# Altium schematic sheet 28_PP0_SGMII, LED, TWSI.SchDoc
size 419 x 296 mm; Author: Serbinov O.A.; CompanyName: ELSICOM; DrawnBy: Serbinov O.A.; Engineer: Serbinov O.A.; Organization: Elsicom; Address1: Kirova avenue, 58; Address2: Tomsk; Address3: Russia 634012; DocumentNumber: 29; SheetNumber: 29; SheetTotal: 44; ProjectName: 48_PORTS
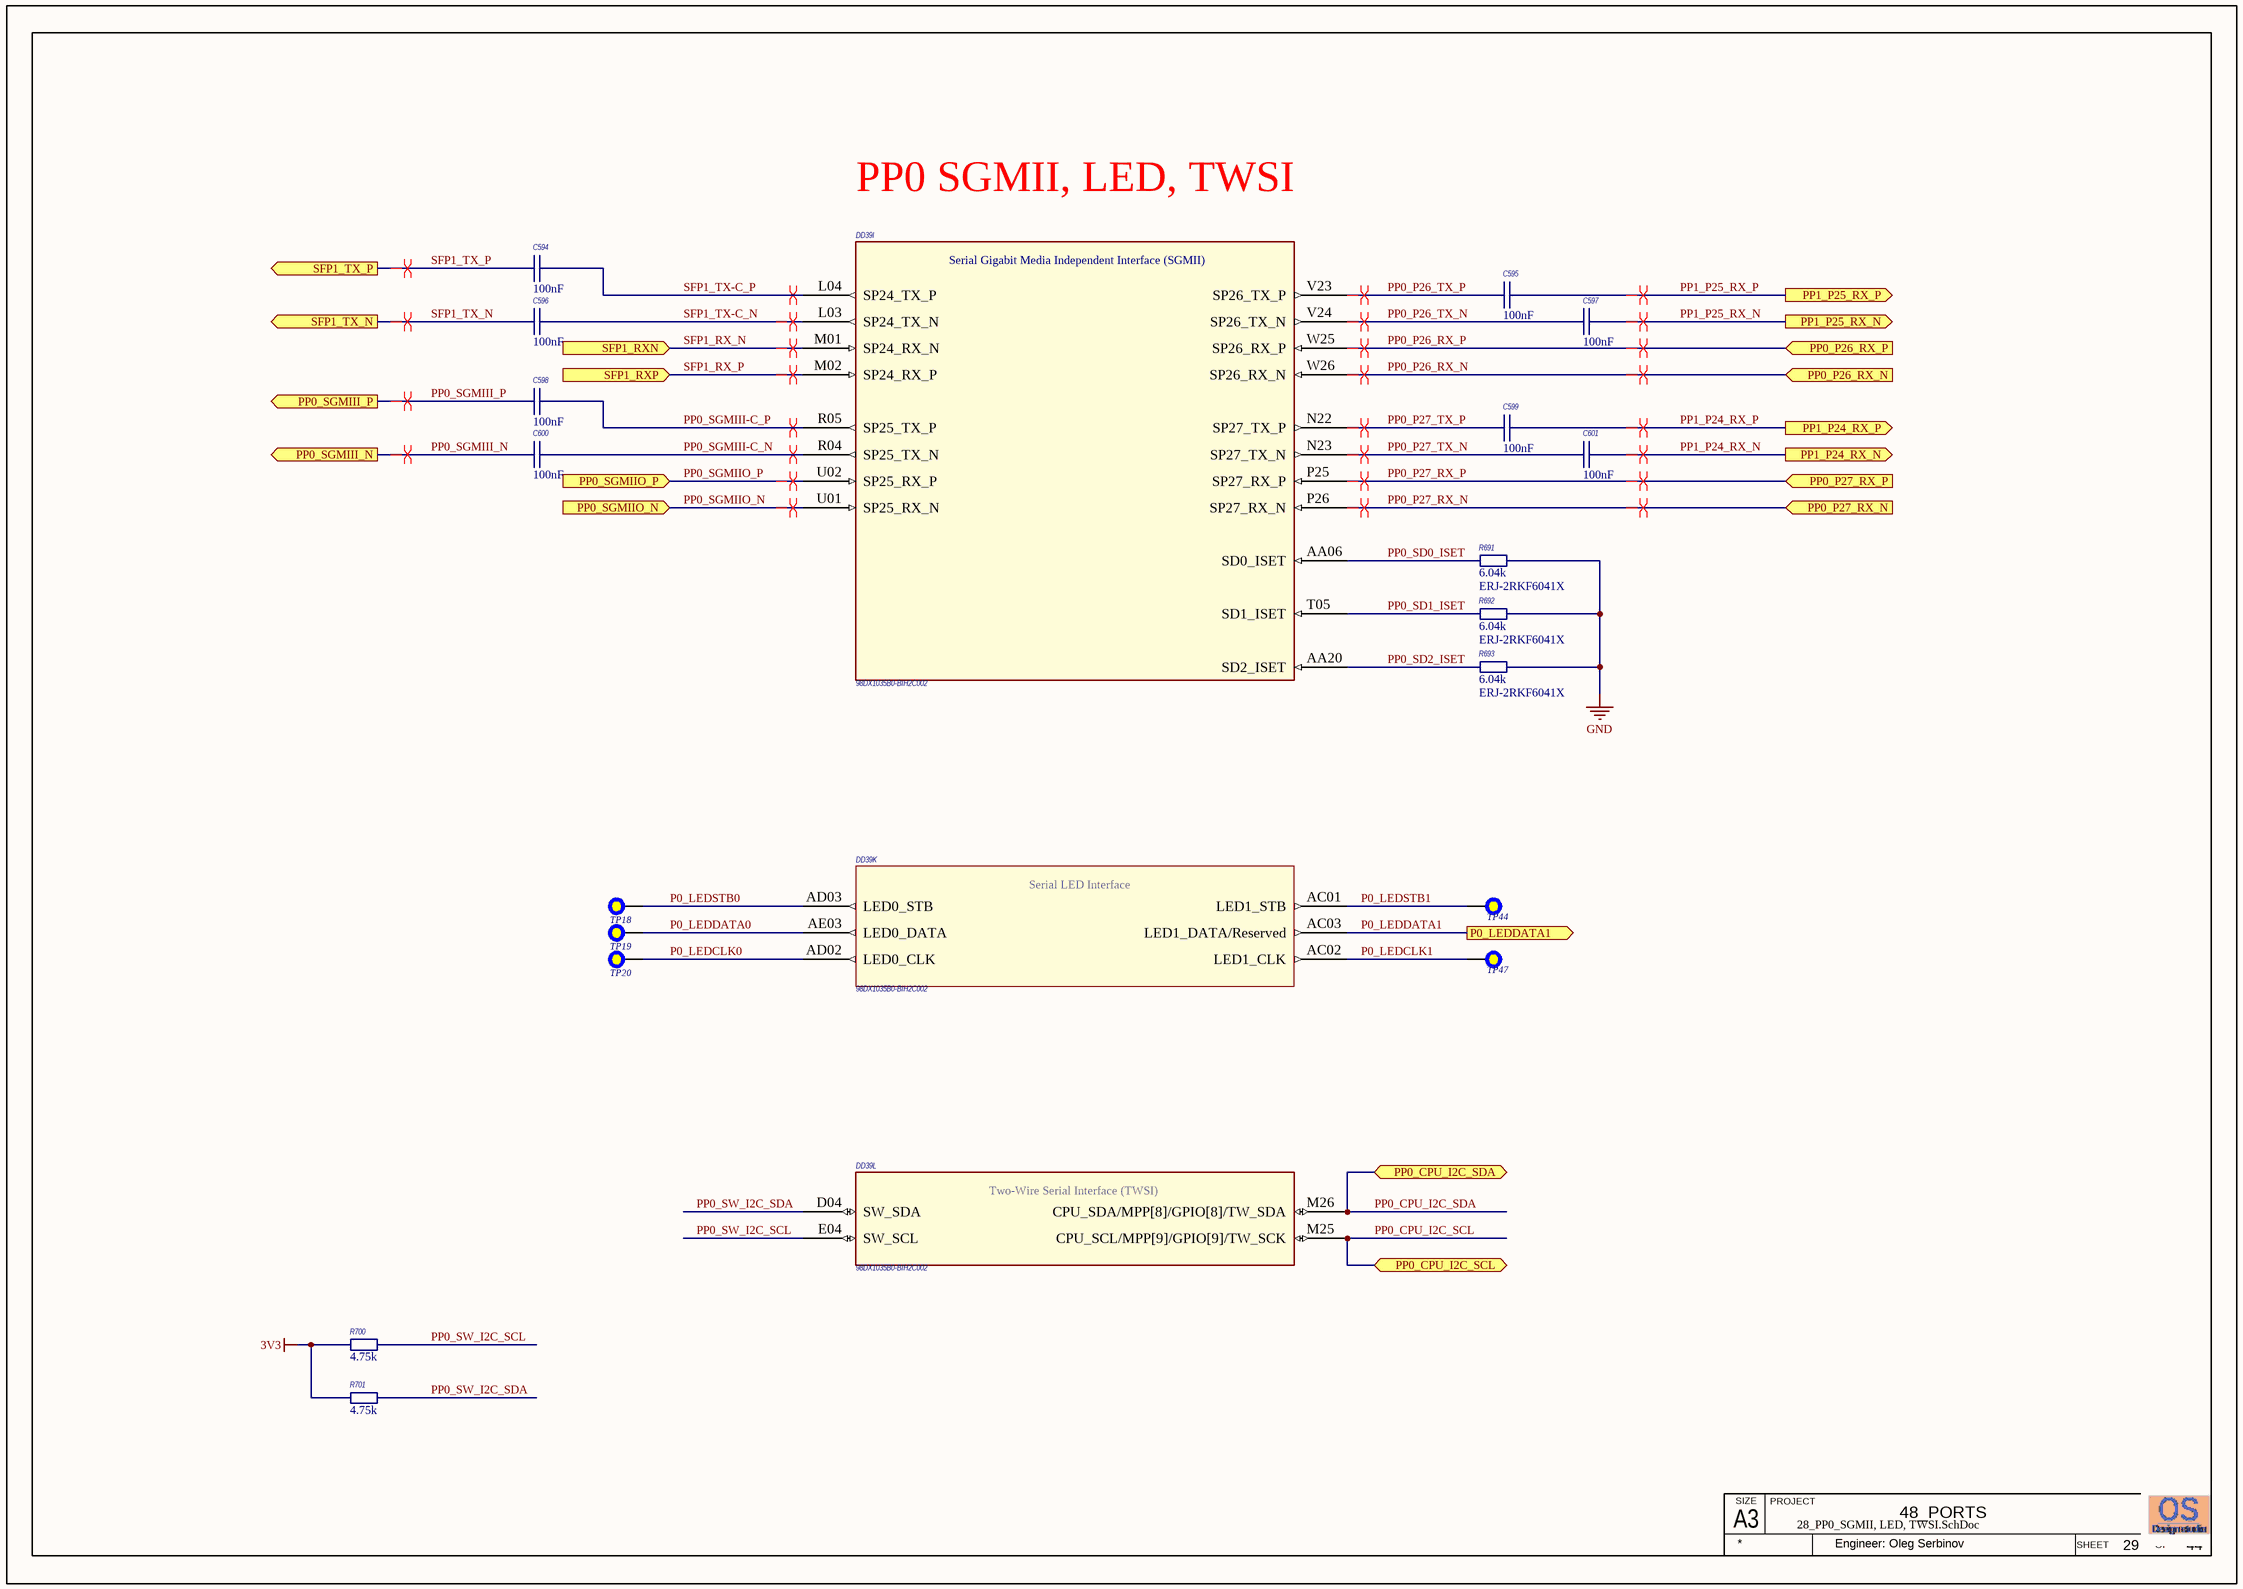
[diagram p0: 28_PP0_SGMII, LED, TWSI.SchDoc]

## Parts
C594  Capacitance: 100nF  [C0402_IPC High Density]  (hidden comment: GRM155R71E104KE14D)
C595  Capacitance: 100nF  [C0402_IPC High Density]  (hidden comment: GRM155R71E104KE14D)
C596  Capacitance: 100nF  [C0402_IPC High Density]  (hidden comment: GRM155R71E104KE14D)
C597  Capacitance: 100nF  [C0402_IPC High Density]  (hidden comment: GRM155R71E104KE14D)
C598  Capacitance: 100nF  [C0402_IPC High Density]  (hidden comment: GRM155R71E104KE14D)
C599  Capacitance: 100nF  [C0402_IPC High Density]  (hidden comment: GRM155R71E104KE14D)
C600  Capacitance: 100nF  [C0402_IPC High Density]  (hidden comment: GRM155R71E104KE14D)
C601  Capacitance: 100nF  [C0402_IPC High Density]  (hidden comment: GRM155R71E104KE14D)
DD39  98DX1035B0-BIH2C002  [HSBGA617_27X27_1MM]  (parts I,K,L of 16)
R691  Resistance (Ohms): 6.04k  [R0402_IPC High Density]  (hidden comment: ERJ-2RKF6041X)
R692  Resistance (Ohms): 6.04k  [R0402_IPC High Density]  (hidden comment: ERJ-2RKF6041X)
R693  Resistance (Ohms): 6.04k  [R0402_IPC High Density]  (hidden comment: ERJ-2RKF6041X)
R700  Resistance (Ohms): 4.75k  [R0402_IPC High Density]  (hidden comment: ERJ-2RKF4751X)
R701  Resistance (Ohms): 4.75k  [R0402_IPC High Density]  (hidden comment: ERJ-2RKF4751X)
TP18  Test Point 0.5mm pad  [Test Point 0.5mm]  (value not drawn)  (no BOM)
TP19  Test Point 0.5mm pad  [Test Point 0.5mm]  (value not drawn)  (no BOM)
TP20  Test Point 0.5mm pad  [Test Point 0.5mm]  (value not drawn)  (no BOM)
TP44  Test Point 0.5mm pad  [Test Point 0.5mm]  (value not drawn)  (no BOM)
TP47  Test Point 0.5mm pad  [Test Point 0.5mm]  (value not drawn)  (no BOM)

## Ports
P0_LEDDATA1 (out), PP0_CPU_I2C_SCL (bidir), PP0_CPU_I2C_SDA (bidir), PP0_P26_RX_N (in), PP0_P26_RX_P (in), PP0_P27_RX_N (in), PP0_P27_RX_P (in), PP0_SGMIII_N (out), PP0_SGMIII_P (out), PP0_SGMIIO_N (in), PP0_SGMIIO_P (in), PP1_P24_RX_N (out), PP1_P24_RX_P (out), PP1_P25_RX_N (out), PP1_P25_RX_P (out), SFP1_RXN (in), SFP1_RXP (in), SFP1_TX_N (out), SFP1_TX_P (out)

## Nets
3V3: R700.1 R701.1
GND: R691.2 R692.2 R693.2
P0_LEDCLK0: DD39.AD02(LED0_CLK) TP20.1
P0_LEDCLK1: DD39.AC02(LED1_CLK) TP47.1
P0_LEDDATA0: DD39.AE03(LED0_DATA) TP19.1
P0_LEDDATA1: DD39.AC03(LED1_DATA/Reserved) ; port P0_LEDDATA1
P0_LEDSTB0: DD39.AD03(LED0_STB) TP18.1
P0_LEDSTB1: DD39.AC01(LED1_STB) TP44.1
PP0_CPU_I2C_SCL: DD39.M25(CPU_SCL/MPP[9]/GPIO[9]/TW_SCK) ; port PP0_CPU_I2C_SCL
PP0_CPU_I2C_SDA: DD39.M26(CPU_SDA/MPP[8]/GPIO[8]/TW_SDA) ; port PP0_CPU_I2C_SDA
PP0_P26_RX_N: DD39.W26(SP26_RX_N) ; port PP0_P26_RX_N
PP0_P26_RX_P: DD39.W25(SP26_RX_P) ; port PP0_P26_RX_P
PP0_P26_TX_N: C597.2 DD39.V24(SP26_TX_N)
PP0_P26_TX_P: C595.2 DD39.V23(SP26_TX_P)
PP0_P27_RX_N: DD39.P26(SP27_RX_N) ; port PP0_P27_RX_N
PP0_P27_RX_P: DD39.P25(SP27_RX_P) ; port PP0_P27_RX_P
PP0_P27_TX_N: C601.2 DD39.N23(SP27_TX_N)
PP0_P27_TX_P: C599.2 DD39.N22(SP27_TX_P)
PP0_SD0_ISET: DD39.AA06(SD0_ISET) R691.1
PP0_SD1_ISET: DD39.T05(SD1_ISET) R692.1
PP0_SD2_ISET: DD39.AA20(SD2_ISET) R693.1
PP0_SGMIII-С_N: C600.1 DD39.R04(SP25_TX_N)
PP0_SGMIII-С_P: C598.1 DD39.R05(SP25_TX_P)
PP0_SGMIII_N: C600.2 ; port PP0_SGMIII_N
PP0_SGMIII_P: C598.2 ; port PP0_SGMIII_P
PP0_SGMIIO_N: DD39.U01(SP25_RX_N) ; port PP0_SGMIIO_N
PP0_SGMIIO_P: DD39.U02(SP25_RX_P) ; port PP0_SGMIIO_P
PP0_SW_I2C_SCL: DD39.E04(SW_SCL) R700.2
PP0_SW_I2C_SDA: DD39.D04(SW_SDA) R701.2
PP1_P24_RX_N: C601.1 ; port PP1_P24_RX_N
PP1_P24_RX_P: C599.1 ; port PP1_P24_RX_P
PP1_P25_RX_N: C597.1 ; port PP1_P25_RX_N
PP1_P25_RX_P: C595.1 ; port PP1_P25_RX_P
SFP1_RX_N: DD39.M01(SP24_RX_N) ; port SFP1_RXN
SFP1_RX_P: DD39.M02(SP24_RX_P) ; port SFP1_RXP
SFP1_TX-С_N: C596.1 DD39.L03(SP24_TX_N)
SFP1_TX-С_P: C594.1 DD39.L04(SP24_TX_P)
SFP1_TX_N: C596.2 ; port SFP1_TX_N
SFP1_TX_P: C594.2 ; port SFP1_TX_P

## Layout directives
differential pair: PP0_P26_RX_N, PP0_P26_RX_P, PP0_P26_TX_N, PP0_P26_TX_P, PP0_P27_RX_N, PP0_P27_RX_P, PP0_P27_TX_N, PP0_P27_TX_P, PP0_SGMIII-С_N, PP0_SGMIII-С_P, PP0_SGMIII_N, PP0_SGMIII_P, PP0_SGMIIO_N, PP0_SGMIIO_P, PP1_P24_RX_N, PP1_P24_RX_P, PP1_P25_RX_N, PP1_P25_RX_P, SFP1_RX_N, SFP1_RX_P, SFP1_TX-С_N, SFP1_TX-С_P, SFP1_TX_N, SFP1_TX_P

## Notes on the sheet
- PP0 SGMII, LED, TWSI
- A3
- SIZE
- PROJECT
- SHEET
- OF
- Engineer: Oleg Serbinov
- (in symbol 98DX1035A1-BIH2C002, part I) Serial Gigabit Media Independent Interface (SGMII)
- (in symbol 98DX1035A1-BIH2C002, part K) Serial LED Interface
- (in symbol 98DX1035A1-BIH2C002, part L) Two-Wire Serial Interface (TWSI)

## Library data of the parts
C594-C601 = GRM155R71E104KE14D: C0402, 100nF, 25V, X7R; Manufacturer: Murata; Rmanufacturer: Yageo  Samsung  TDK  Taiyo Yuden  Kemet; Customer Part Number: Конденсатор, 100n, 0402, 25V, X7R, 10%; Capacitance Tolerance: ± 10%; Voltage Rating: 16; Capacitor Case Style: 0402 [1005 Metric]; Capacitor Terminals: SMD; SVHC: No SVHC (19-Dec-2012); No. of Pins: 2; Reel Quantity: 10000; Tolerance +: 10%; Analogs: any suitable; Manufacturer Part Number: GRM155R71E104KE14D; RoHS: YES; Packaging: Reel; Package / Case: 0402; ComponentLink1URL: http://www.farnell.com/datasheets/4360.pdf; ComponentLink1Description: http://www.farnell.com/datasheets/4360.pdf; Pricing: 10000=0.008593, 30000=0.007991 (GBP); Supplier 1: Farnell; Supplier Part Number 1: 1118151; Stock: 3; Dielectric Characteristic: X7R; Operating Temperature Min: -55; Operating Temperature Max: 125; Operating Temperature Range: -55°C to +125; Series: GRM Hi-Cap; Terminal Type: Surface Mount (SMD, SMT); Tolerance -: 10%; Voltage Rating V DC: 16
DD39 = 98DX1035A1-BIH2C002: IC 24-PORT FE  4-PORT 2.5GE L2 ENTRY-LEVEL, CPU; Customer Part Number: Микросхема, 98DX1035B0-BIH2C002, IC 24-PORT FE 4-PORT 2.5GE L2 ENTRY-LEVEL, HSBGA617SBGA617; Manufacturer: Marvell Technology Group; Manufacturer Part Number: 98DX1035B0-BIH2C002
R691-R693 = ERJ-2RKF6041X: R0402, 6.04k 1%; Manufacturer: Panasonic; Rpart number: RC0402FR-076K04L ; RC1005F6041CS ; RMCF0402FT6K04 ; CRCW04026K04FKED ; TRR01MZPF6041 ; RC-02W6041FT; Rmanufacturer: Yageo  Samsung  Stackpole Electronics  Rohm Semiconductor  Vishay Dale; Customer Part Number: Резистор, 6K04, 0402, 1%; Description 1: RES 6.04K OHM 1/10W 1% 0402 SMD; Category 1: Resistors; Power (Watts): 0.1W, 1/10W; Temperature Coefficient: ±100ppm/°C; Analogs: any suitable; Tolerance: ±1%; Supplier 1: Digi-Key; Supplier Part Number 1: P6.04KLCT-ND; RoHS 1: RoHS Compliant; Stock 1: 566346; Pricing 1: 1=0.1, 50=0.0242, 100=0.0184, 250=0.01364, 500=0.01008, 1000=0.00672, 5000=0.00473 (USD); Composition: Thick Film; Features: -; Package / Case: 0402 (1005 Metric); Size / Dimension: 0.039" L x 0.020" W (1.00mm x 0.50mm); Height: 0.016" (0.40mm); Number of Terminations: 2; Packaging: Cut Tape (CT); ComponentLink1URL: http://industrial.panasonic.com/www-cgi/jvcr13pz.cgi?E+PZ+3+AOA0002+ERJ2RKF6041X+7+WW; ComponentLink1Description: http://industrial.panasonic.com/www-cgi/jvcr13pz.cgi?E+PZ+3+AOA0002+ERJ2RKF6041X+7+WW; RoHS: RoHS Compliant; Supplier Part Number: P6.04KLCT-ND; Category: Resistors; Supplier: Digi-Key; Pricing: 1=0.1, 50=0.0242, 100=0.0184, 250=0.01364, 500=0.01008, 1000=0.00672, 5000=0.00473 (USD); Manufacturer Part Number: ERJ-2RKF6041X
R700 R701 = ERJ-2RKF4751X: R0402, 4.75k 1%; Manufacturer: Panasonic; Rpart number: RC0402FR-074K75L ; RC1005F4751CS ; RMCF0402FT4K75 ; CRCW04024K75FKED ; TRR01MZPF4751; Rmanufacturer: Yageo  Samsung  Stackpole Electronics  Rohm Semiconductor  Vishay Dale; Customer Part Number: Резистор, 4K75, 0402, 1%; Temperature Coefficient: ±100ppm/°C; Power (Watts): 0.1W, 1/10W; Analogs: any suitable; Tolerance: ±1%; Packaging: Cut Tape (CT); Package / Case: 0402 (1005 Metric); Category: Resistors; Manufacturer Part Number: ERJ-2RKF4751X; Supplier Part Number: P4.75KLCT-ND; RoHS: RoHS Compliant; Supplier: Digi-Key; ComponentLink1URL: http://industrial.panasonic.com/www-cgi/jvcr13pz.cgi?E+PZ+3+AOA0002+ERJ2RKF4751X+7+WW; ComponentLink1Description: http://industrial.panasonic.com/www-cgi/jvcr13pz.cgi?E+PZ+3+AOA0002+ERJ2RKF4751X+7+WW; Features: -; Composition: Thick Film; Height: 0.016" (0.40mm); Number of Terminations: 2; Supplier Device Package: 0402; Size / Dimension: 0.039" L x 0.020" W (1.00mm x 0.50mm)